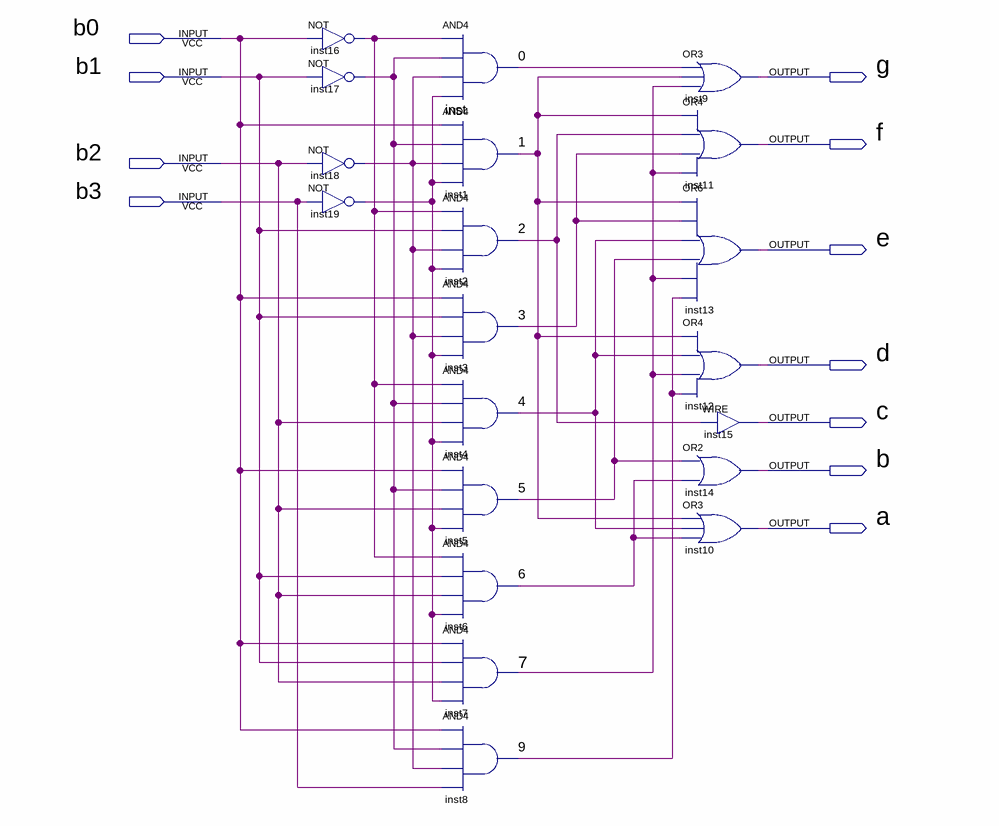
[diagram p0: schematic sheet]
// Quartus schematic BCD_7seg_A.bdf as structural Verilog: 20 symbols, 11 pins
module BCD_7seg_A (
  input  b0,
  input  b1,
  input  b2,
  input  b3,
  output g,
  output f,
  output e,
  output d,
  output c,
  output b,
  output a
);

  wire \0 , \1 , \2 , \3 , \4 , \5 , \6 , \7 , \9 , inst16_out, inst17_out, inst18_out, inst19_out;

  not inst16 (inst16_out, b0);
  not inst17 (inst17_out, b1);
  not inst18 (inst18_out, b2);
  not inst19 (inst19_out, b3);
  and inst (\0 , inst16_out, inst17_out, inst18_out, inst19_out);
  and inst1 (\1 , b0, inst17_out, inst18_out, inst19_out);
  and inst2 (\2 , inst16_out, b1, inst18_out, inst19_out);
  and inst3 (\3 , b0, b1, inst18_out, inst19_out);
  and inst4 (\4 , inst16_out, inst17_out, b2, inst19_out);
  and inst5 (\5 , b0, inst17_out, b2, inst19_out);
  and inst6 (\6 , inst16_out, b1, b2, inst19_out);
  and inst7 (\7 , b0, b1, b2, inst19_out);
  and inst8 (\9 , b0, inst17_out, inst18_out, b3);
  or inst9 (g, \0 , \1 , \7 );
  or inst11 (f, \1 , \2 , \3 , \7 );
  or inst13 (e, \1 , \3 , \4 , \5 , \7 , \9 );
  or inst12 (d, \1 , \4 , \7 , \9 );
  or inst14 (b, \5 , \6 );
  or inst10 (a, \1 , \4 , \6 );
  assign c = \2 ;  // WIRE inst15
endmodule
